# Altium schematic sheet 4 memory.SchDoc
size A4; DocumentNumber: 4; SheetNumber: 6; SheetTotal: 12
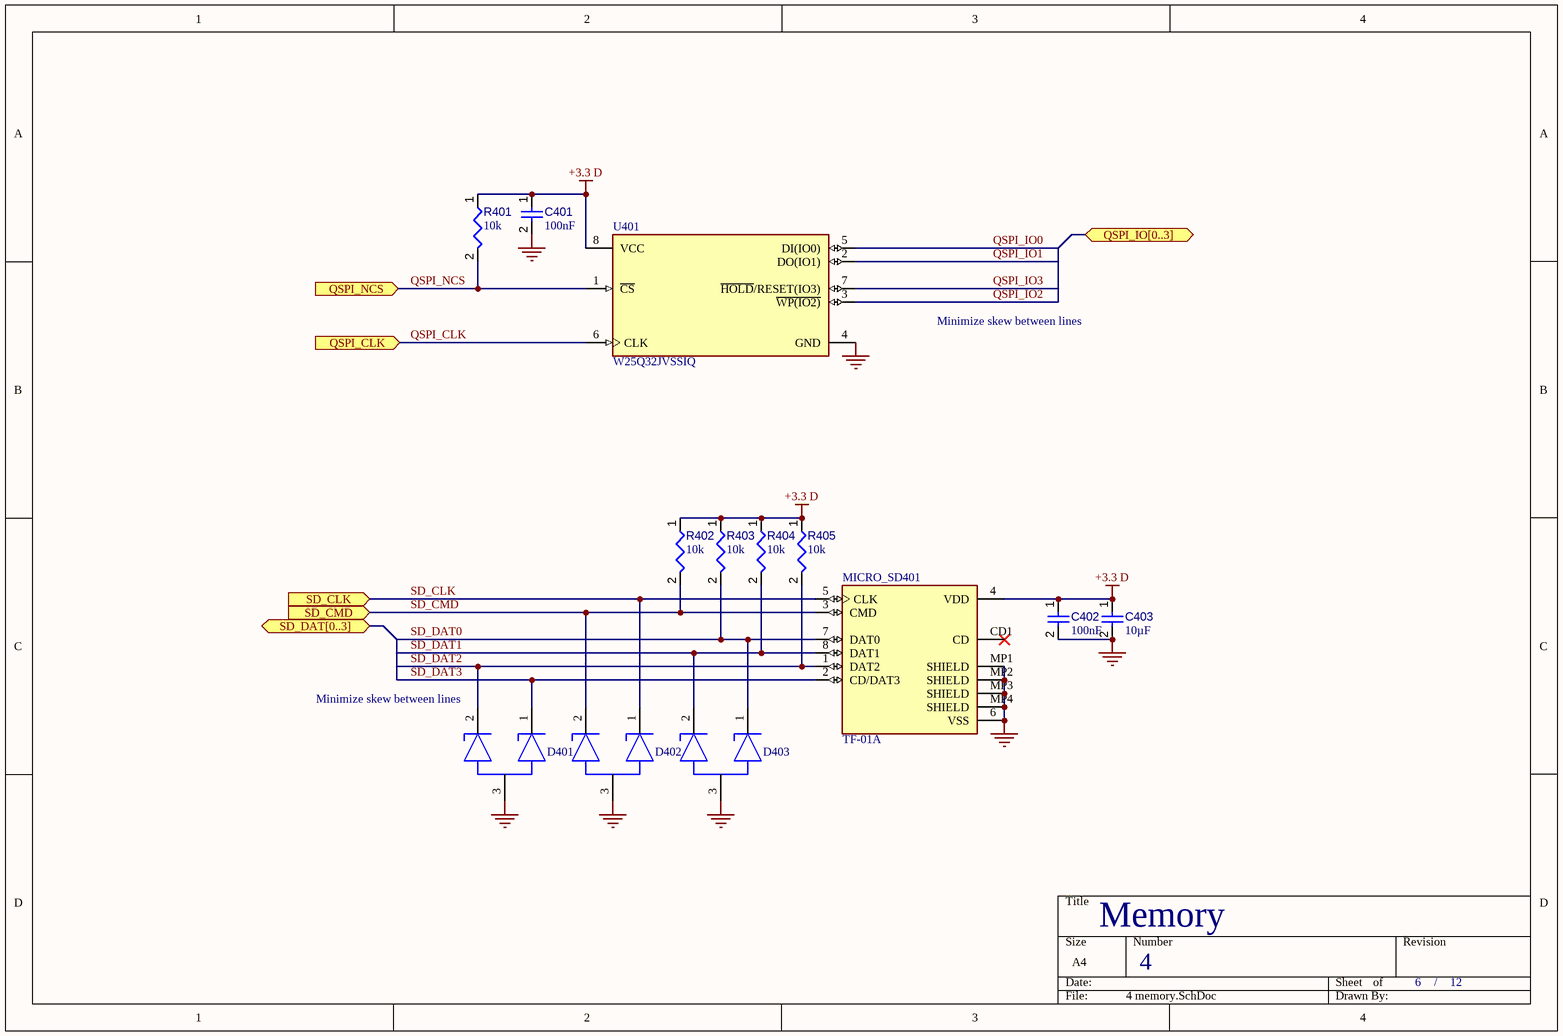
[diagram p0: 4 memory.SchDoc]

## Parts
C401  value 100nF  [CAPC0402(1005)60_L]  (hidden comment: Capacitor 100nF +/-20% 25V 0402)
C402  value 100nF  [CAPC0402(1005)60_L]  (hidden comment: Capacitor 100nF +/-20% 25V 0402)
C403  value 10µF  [CAPC0603(1608)100_L]  (hidden comment: Capacitor 10µF +/-20% 10V 0603)
D401  PESD3V3S2UT,215  [FP-SOT23-IPC_A]  (value not drawn)
D402  PESD3V3S2UT,215  [FP-SOT23-IPC_A]  (value not drawn)
D403  PESD3V3S2UT,215  [FP-SOT23-IPC_A]  (value not drawn)
MICRO_SD401  TF-01A  [TF-01A]
R401  value 10k  [RESC0402(1005)_L]  (hidden comment: Resistor 10K  +/-1 % 0402 63 mW)
R402  value 10k  [RESC0402(1005)_L]  (hidden comment: Resistor 10K  +/-1 % 0402 63 mW)
R403  value 10k  [RESC0402(1005)_L]  (hidden comment: Resistor 10K  +/-1 % 0402 63 mW)
R404  value 10k  [RESC0402(1005)_L]  (hidden comment: Resistor 10K  +/-1 % 0402 63 mW)
R405  value 10k  [RESC0402(1005)_L]  (hidden comment: Resistor 10K  +/-1 % 0402 63 mW)
U401  W25Q32JVSSIQ  [FP-SS-IPC_C]

## Ports
QSPI_CLK (in), QSPI_IO[0..3] (bidir), QSPI_NCS (in), SD_CLK (in), SD_CMD (in), SD_DAT[0..3] (bidir)

## Nets
+3.3 D: C401.1 C402.1 C403.1 MICRO_SD401.4(VDD) R401.1 R402.1 R403.1 R404.1 R405.1 U401.8(VCC)
GND: C401.2 C402.2 C403.2 D401.3 D402.3 D403.3 MICRO_SD401.6(VSS) MICRO_SD401.MP1(SHIELD) MICRO_SD401.MP2(SHIELD) MICRO_SD401.MP3(SHIELD) MICRO_SD401.MP4(SHIELD) U401.4(GND)
QSPI_CLK: U401.6(CLK) ; port QSPI_CLK
QSPI_IO0: U401.5(DI(IO0))
QSPI_IO1: U401.2(DO(IO1))
QSPI_IO2: U401.3(~{WP(IO2)})
QSPI_IO3: U401.7(~{HOLD}/RESET(IO3))
QSPI_NCS: R401.2 U401.1(~{CS}) ; port QSPI_NCS
SD_CLK: D402.1 MICRO_SD401.5(CLK) ; port SD_CLK
SD_CMD: D402.2 MICRO_SD401.3(CMD) R402.2 ; port SD_CMD
SD_DAT0: D403.1 MICRO_SD401.7(DAT0) R403.2
SD_DAT1: D403.2 MICRO_SD401.8(DAT1) R404.2
SD_DAT2: D401.2 MICRO_SD401.1(DAT2) R405.2
SD_DAT3: D401.1 MICRO_SD401.2(CD/DAT3)

Not connected (* = marked no-connect by the designer): MICRO_SD401 CD1(CD)*

## Notes on the sheet
- Minimize skew between lines
- (near D401) Minimize skew between lines
- Memory
- /

## Library data of the parts
C401 C402 = CMP-001-00065-4: Chip Capacitor, 100nF +/-20%, 25V, 0402, Thickness 0.6 mm; Tolerance: 10%; Max Operating Temperature: 85°C; Min Operating Temperature: -55°C; Pins: 2; Voltage Rating: 25V; Mounting Technology: SMT; Case/Package: 0402
C403 = CMP-001-00075-4: Chip Capacitor, 10µF +/-20%, 10V, 0603, Thickness 1 mm; Tolerance: 10%; Voltage Rating: 10V; Max Operating Temperature: 85°C; Pins: 2; Case/Package: 0603; Mounting Technology: SMT; Min Operating Temperature: -55°C
D401-D403 = CMP-14432-000008-1: TVS DIODE 3.3VWM 20VC TO236AB; RoHS Compliant: Yes
MICRO_SD401 = TF-01A: Standard Card Edge Connectors; MF: HRO Electronics Co., Ltd.; Price: None; Availability: Not in stock; MP: TF-01A; Package: Package; SnapEDA_Link: https://www.snapeda.com/parts/TF-01A/HRO+Electronics+Co.%252C+Ltd./view-part/?ref=snap; Check_prices: https://www.snapeda.com/parts/TF-01A/HRO+Electronics+Co.%252C+Ltd./view-part/?ref=eda; Value: *
R401-R405 = CMP-009-00149-3: Chip Resistor, 10 kOhms, +/-1 %, 63 mW, -55 to 125 degC, 0402; Power: 63mW; Tolerance: 1%; Min Operating Temperature: -55°C; Case/Package: 0402; Max Operating Temperature: 155°C; Pins: 2
U401 = CMP-2000-05006-2: IC FLASH 32M SPI 104MHZ 8SOIC; Manufacturer: Winbond; Obsolete Part: true; Access Time: 7ns; Nominal Supply Current: 8-20mA; Memory Size: 32Mbits; Max Supply Voltage: 3.6V; Min Supply Voltage: 2.7V; Standoff Height: 0.05mm; Interface: SPI,Other; Package: SS; Memory Type: FLASH; Ipc Land Pattern Name: SOIC127P790X195-8; Temperature Range High: +85°C; Temperature: -40°C to +85°C; Octopart: https://octopart.com/w25q32fvssig-winbond-23896462; Manufacturer Part Number: W25Q32JVSSIQ; Ambient Temperature Range Low: -40°C; Lead Free: Yes; Height: 2.16mm; Automotive: No; Device Class L2: Memory; Digikey Description: IC FLASH 32M SPI 104MHZ 8SOIC; RoHS: TRUE; Frequency: 104MHz; Ambient Temperature Range High: +85°C; ComponentLink2Description: Datasheet; Category: IC; Device Class L1: Integrated Circuits (ICs); Device Class L3: Flash; Temperature Range Low: -40°C; Footprint Url: http://www.winbond.com/resource-files/an0000009%20spiflash%20pcb%20layout%20guideline%20v2.0%2009252017.pdf?__locale=en; ComponentLink2URL: https://www.winbond.com/resource-files/w25q32fv%20revj%2006032016.pdf